# Altium schematic sheet MatchX_SoM24.SchDoc: =title
size A3; PageSetup: Record=PageOptions|CenterHorizontal=True|CenterVertical=True|PrintScale=1.00|XCorrection=1.00|YCorrection=1.00|PrintKind=0|BorderSize=5000000|LeftOffset=0|BottomOffset=0|Orientation=2|PaperLength=1000|PaperWidth=1000|Scale=100|PaperSource=15|PrintQuality=600|MediaType=1|DitherType=10|PaperKind=Letter|PrintScaleMode=1; DocumentNumber: 5; SheetNumber: 4; SheetTotal: 7
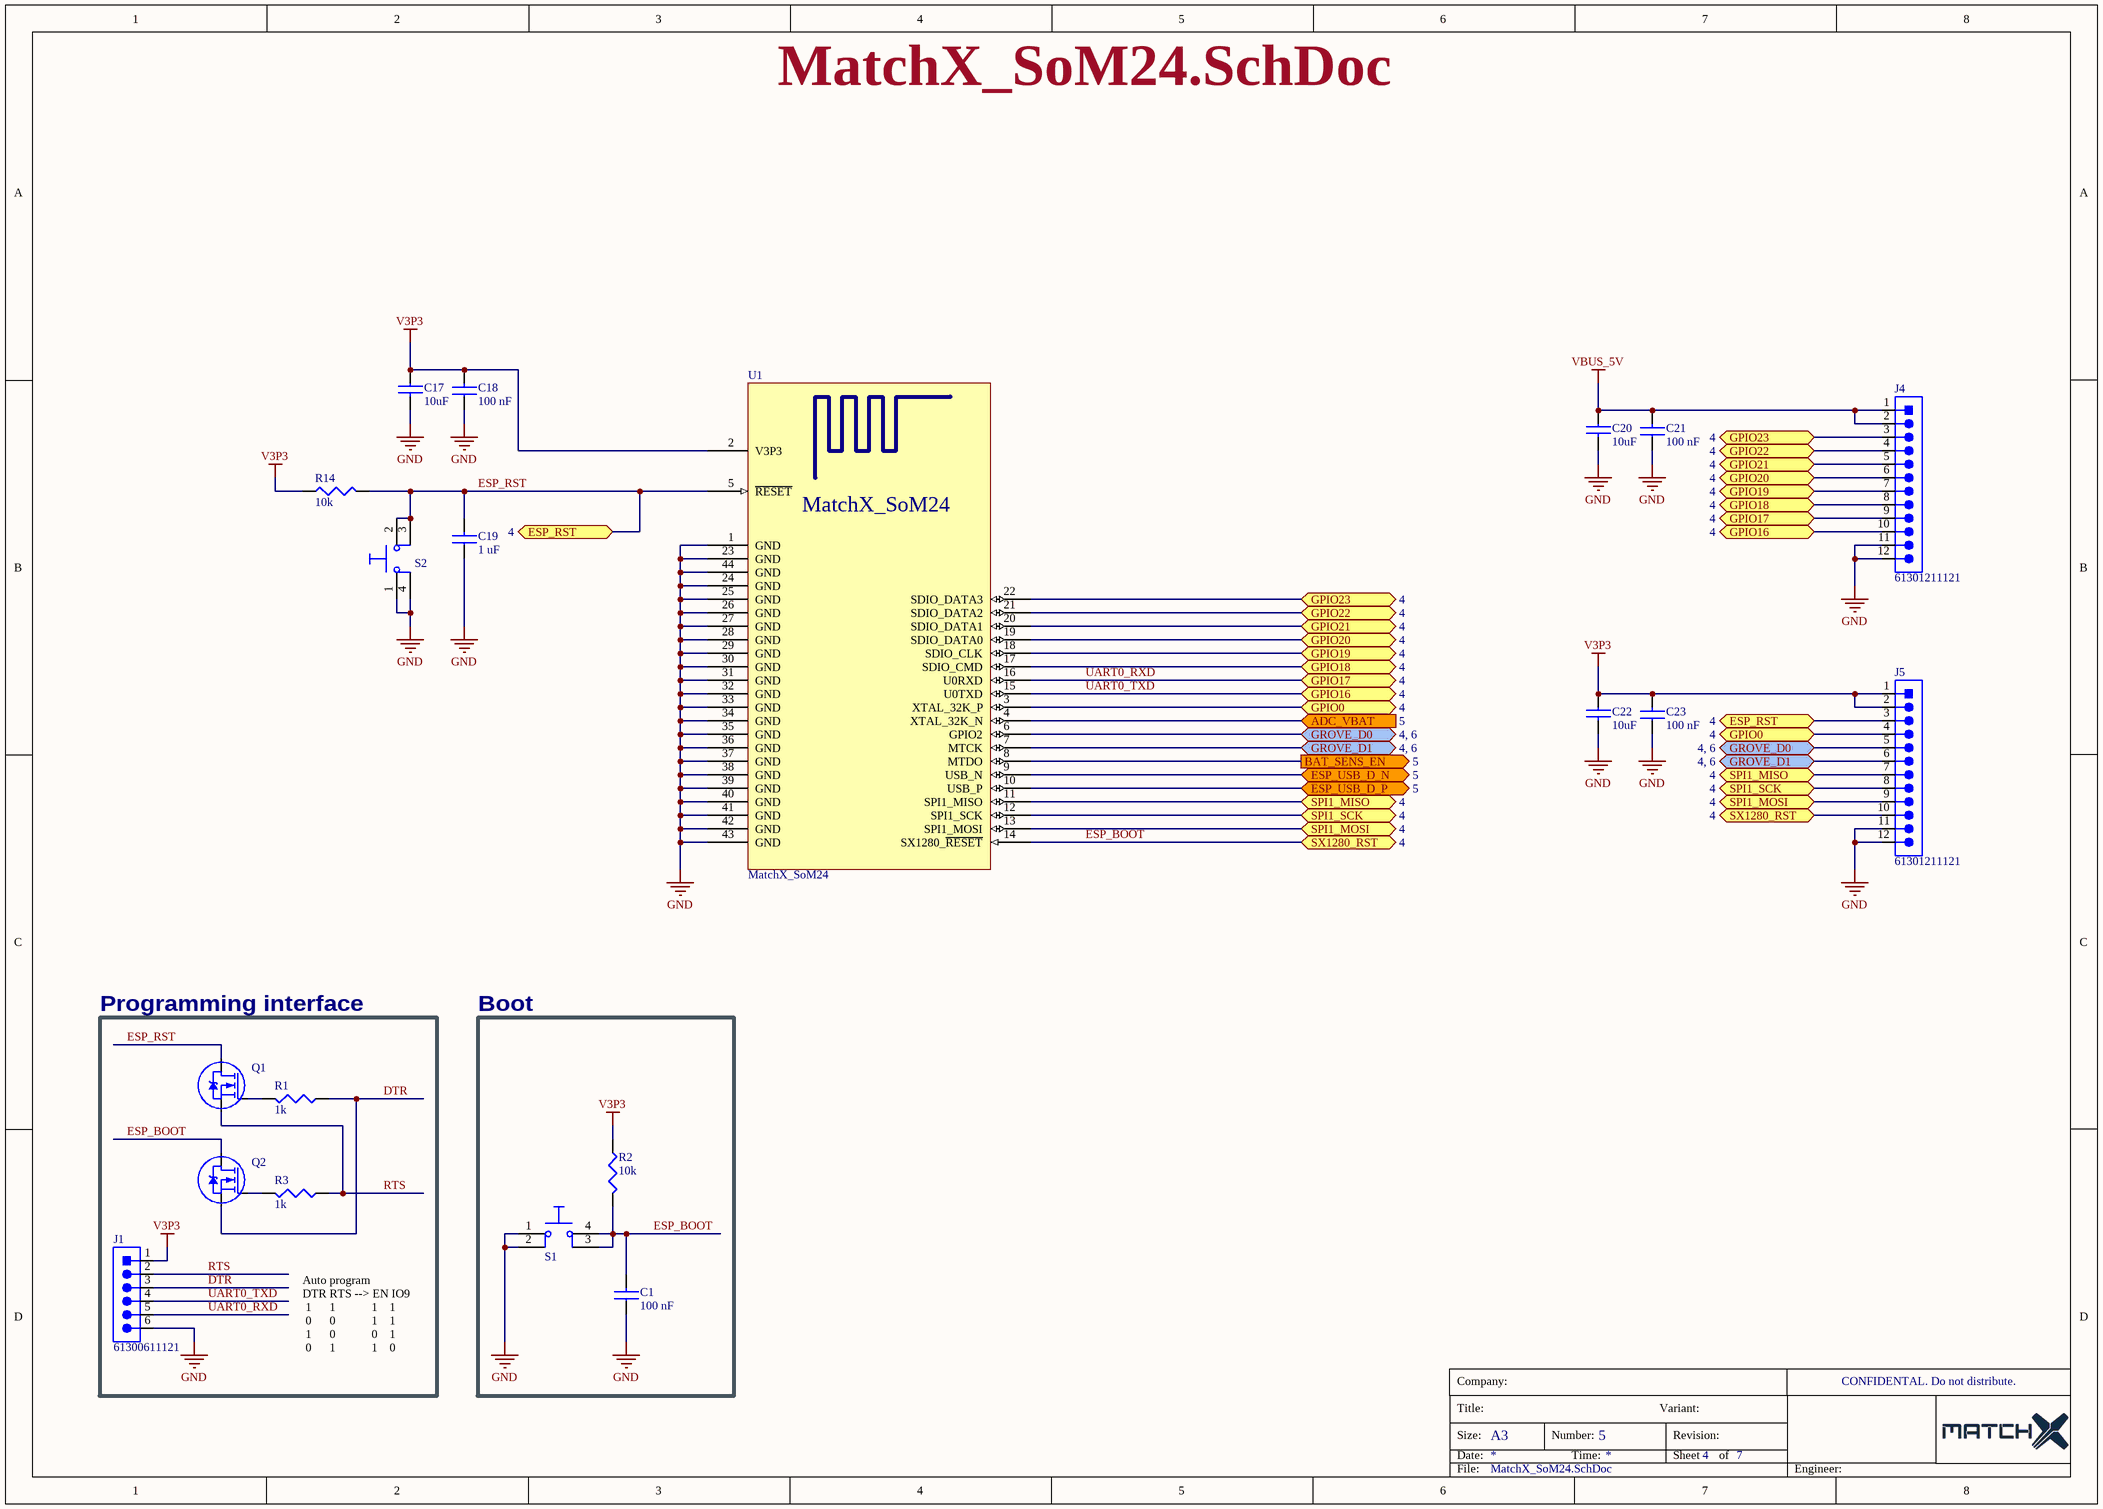
[diagram p0: MatchX_SoM24.SchDoc]

## Parts
C1  100 nF  [C0603]
C17  10uF  [C0805]
C18  100 nF  [C0603]
C19  1 uF  [C0603]
C20  10uF  [C0805]
C21  100 nF  [C0603]
C22  10uF  [C0805]
C23  100 nF  [C0603]
J1  61300611121  [WURTH_61300611121]
J4  61301211121  [WURTH_61301211121]
J5  61301211121  [WURTH_61301211121]
Q1  DMN3023L-7  [SOT-23]  (value not drawn)
Q2  DMN3023L-7  [SOT-23]  (value not drawn)
R1  1k  [R0603]
R2  10k  [R0402]
R3  1k  [R0603]
R14  10k  [R0402]
S1  TS-1108A  [TS-1108A]  (value not drawn)
S2  TS-1108A  [TS-1108A]  (value not drawn)
U1  MatchX_SoM24  [MatchX_SoM24]

## Blocks framed on the sheet
Programming interface: J1 Q1 Q2 R1 R3
Boot: C1 R2 S1

## Ports
ADC_VBAT (in, see 5), BAT_SENS_EN (out, see 5), ESP_RST (bidir, see 4), ESP_USB_D_N (bidir, see 5), ESP_USB_D_P (bidir, see 5), GPIO0 (bidir, see 4), GPIO16 (bidir, see 4), GPIO17 (bidir, see 4), GPIO18 (bidir, see 4), GPIO19 (bidir, see 4), GPIO20 (bidir, see 4), GPIO21 (bidir, see 4), GPIO22 (bidir, see 4), GPIO23 (bidir, see 4), GROVE_D0 (bidir, see 4, 6), GROVE_D1 (bidir, see 4, 6), SPI1_MISO (bidir, see 4), SPI1_MOSI (bidir, see 4), SPI1_SCK (bidir, see 4), SX1280_RST (bidir, see 4)

## Nets
GND: C1.1 C17.2 C18.1 C19.1 C20.2 C21.1 C22.2 C23.1 J1.6 J4.11 J4.12 J5.11 J5.12 S1.1 S1.2 S2.1 S2.4 U1.1(GND) U1.23(GND) U1.24(GND) U1.25(GND) U1.26(GND) U1.27(GND) U1.28(GND) U1.29(GND) U1.30(GND) U1.31(GND) U1.32(GND) U1.33(GND) U1.34(GND) U1.35(GND) U1.36(GND) U1.37(GND) U1.38(GND) U1.39(GND) U1.40(GND) U1.41(GND) U1.42(GND) U1.43(GND) U1.44(GND)
V3P3: C17.1 C18.2 C22.1 C23.2 J1.1 J5.1 J5.2 R2.1 R14.1 U1.2(V3P3)
VBUS_5V: C20.1 C21.2 J4.1 J4.2
ADC_VBAT: U1.4(XTAL_32K_N) ; port ADC_VBAT
BAT_SENS_EN: U1.8(MTDO) ; port BAT_SENS_EN
DTR: J1.3 Q2.2(S) R1.2
ESP_BOOT: C1.2 J5.10 Q2.3(D) R2.2 S1.3 S1.4 U1.14(SX1280_~{RESET}) ; port SX1280_RST
ESP_RST: C19.2 J5.3 Q1.3(D) R14.2 S2.2 S2.3 U1.5(~{RESET}) ; port ESP_RST
ESP_USB_D_N: U1.9(USB_N) ; port ESP_USB_D_N
ESP_USB_D_P: U1.10(USB_P) ; port ESP_USB_D_P
GPIO0: J5.4 U1.3(XTAL_32K_P) ; port GPIO0
GPIO18: J4.8 U1.17(SDIO_CMD) ; port GPIO18
GPIO19: J4.7 U1.18(SDIO_CLK) ; port GPIO19
GPIO20: J4.6 U1.19(SDIO_DATA0) ; port GPIO20
GPIO21: J4.5 U1.20(SDIO_DATA1) ; port GPIO21
GPIO22: J4.4 U1.21(SDIO_DATA2) ; port GPIO22
GPIO23: J4.3 U1.22(SDIO_DATA3) ; port GPIO23
GROVE_D0: J5.5 U1.6(GPIO2) ; port GROVE_D0
GROVE_D1: J5.6 U1.7(MTCK) ; port GROVE_D1
RTS: J1.2 Q1.2(S) R3.2
SPI1_MISO: J5.7 U1.11(SPI1_MISO) ; port SPI1_MISO
SPI1_MOSI: J5.9 U1.13(SPI1_MOSI) ; port SPI1_MOSI
SPI1_SCK: J5.8 U1.12(SPI1_SCK) ; port SPI1_SCK
UART0_RXD: J1.5 J4.9 U1.16(U0RXD) ; port GPIO17
UART0_TXD: J1.4 J4.10 U1.15(U0TXD) ; port GPIO16
NetQ1_1: Q1.1(G) R1.1
NetQ2_1: Q2.1(G) R3.1

## Notes on the sheet
- Auto program
  DTR RTS --> EN IO9
  1      1            1    1
  0      0            1    1
  1      0            0    1
  0      1            1    0
- Company:
- CONFIDENTAL. Do not distribute.
- Title:
- Size:
- Date:
- A3
- Number:
- Time:
- Variant:
- Revision:
- Sheet
- of
- File:
- Engineer:

## Library data of the parts
C1 C18 C21 C23 = C0603-100nF_50V: CAP, CERM, 100 nF, 50V, +/- 10%, X7R, 0603; CompType: Capacitor; Category: Capacitors; Operating Temperature: -55°C ~ 125°C; Package / Case: 0603 (1608 Metric); RoHS: RoHS Compliant; Temperature Coefficient: X7R; Tolerance: 10%; Voltage - Rated: 50V; MountType: SMT; Technology: Ceramic; Value: 100 nF
C17 C20 C22 = C0805-10uF_16V: CAP, CERM, 10uF, 16V, +/- 20%, X5R, 0805; CompType: Capacitor; Category: Capacitors; Operating Temperature: -55°C ~ 85°C; Package / Case: 0805 (2012 Metric); RoHS: RoHS Compliant; Temperature Coefficient: X5R; Tolerance: 20%; Voltage - Rated: 16 V; MountType: SMT; Technology: Ceramic; Value: 10uF
C19 = C0603-1uF_25V: CAP, CERM, 1 uF, 25 V, +/- 10%, X7R, 0603; Voltage - Rated: 25 V; CompType: Capacitor; Category: Capacitors; Operating Temperature: -55°C ~ 125°C; Package / Case: 0603 (1608 Metric); RoHS: RoHS Compliant; Temperature Coefficient: X7R; Tolerance: 10%; MountType: SMT; Technology: Ceramic; Value: 1 uF
J1 = CON_61300611121: Header, 2.54 mm, 6x1, Gold, TH; Manufacturer: Wurth Electronics; Connector Type: Header, Unshrouded; Number of Positions: 6; Number of Positions Loaded: All; Pitch: 0.100" (2.54mm); Supplier 1: Digikey; Supplier Part Number 1: 732-5318-ND; Manufacturer Part Number: 61300611121; Stock 1: 0; Pricing 1: 1=0.25, 10=0.209, 25=0.174, 50=0.145, 100=0.132, 1000=0.12 (USD); Category: Connectors, Interconnects; Family: Rectangular Connectors - Headers, Male Pins; Series: WR-PHD; Packaging: Bulk; Contact Type: Male Pin; Number of Rows: 1; Row Spacing: -; Contact Mating Length: 0.236" (6.00mm); Mounting Type: Through Hole; Termination: Solder; Fastening Type: -; Features: -; Contact Finish: Gold; Contact Finish Thickness: -; Color: Black; ComponentLink1URL: http://www.farnell.com/cad/1737268.pdf; ComponentLink1Description: http://www.farnell.com/cad/1737268.pdf
J4 J5 = CON_61301211121: Header, 2.54 mm, 12x1, Gold, TH; Manufacturer: Wurth Electronics; Connector Type: Header, Unshrouded; Number of Positions: 12; Number of Positions Loaded: All; Pitch: 0.100" (2.54mm); Supplier 1: Digikey; Supplier Part Number 1: 732-5323-ND; Manufacturer Part Number: 61301211121; Stock 1: 459; Pricing 1: 1=0.54, 10=0.454, 25=0.3792, 50=0.316, 100=0.287, 1000=0.261 (USD); Category: Connectors, Interconnects; Family: Rectangular Connectors - Headers, Male Pins; Series: WR-PHD; Packaging: Bulk; Contact Type: Male Pin; Number of Rows: 1; Row Spacing: -; Contact Mating Length: 0.236" (6.00mm); Mounting Type: Through Hole; Termination: Solder; Fastening Type: -; Features: -; Contact Finish: Gold; Contact Finish Thickness: -; Color: Black; ComponentLink1URL: http://www.farnell.com/cad/1737268.pdf; ComponentLink1Description: http://www.farnell.com/cad/1737268.pdf
Q1 Q2 = NMOSFET_DMN3023L-7: MOSFETN-CH 30V 6.2A SOT23-3; Manufacturer: Diodes; .Checked PCB: OK M; Rds On Max: 25mR; Input Capacitance: 873pF; Max Power Dissipation: 900mW; Supplier 1: Digi-Key; Supplier Part Number 1: DMN3023L-7DICT-ND; Manufacturer Part Number: DMN3023L-7; RoHS: Yes; Category: MOSFETs; Stock 1: 420813; Pricing 1: 1=0,41000, 10=0,33100, 100=0,22560, 500=0,16922, 1000=0,12692 (USD); RoHS Compliant: Yes; ComponentLink1URL: http://www.farnell.com/datasheets/2814401.pdf?src-supplier=Farnell; ComponentLink1Description: http://www.farnell.com/datasheets/2814401.pdf?src-supplier=Farnell; ComponentLink2URL: http://www.mouser.com/ds/2/115/DMN3023L-959533.pdf?src-supplier=Mouser; ComponentLink2Description: http://www.mouser.com/ds/2/115/DMN3023L-959533.pdf?src-supplier=Mouser; ComponentLink3URL: http://www.farnell.com/datasheets/2814401.pdf?src-supplier=Newark; ComponentLink3Description: http://www.farnell.com/datasheets/2814401.pdf?src-supplier=Newark; ComponentLink4URL: http://www.farnell.com/datasheets/2814401.pdf?src-supplier=Element14; ComponentLink4Description: http://www.farnell.com/datasheets/2814401.pdf?src-supplier=Element14; .Checked SCH: OK M; Mount: Surface Mount; Case/Package: TO-236-3; Min Operating Temperature: -55°C; Max Operating Temperature: 150°C; Packaging: Tape and Reel; Drain to Source Voltage (Vdss): 30V; Continuous Drain Current (ID): 6.2A; ComponentLink5URL: https://www.diodes.com/assets/Datasheets/DMN3023L.pdf?src-supplier=Digi-Key; ComponentLink5Description: https://www.diodes.com/assets/Datasheets/DMN3023L.pdf?src-supplier=Digi-Key
R1 R3 = R0603-1k: RES, 1k, 1%, 0.063 W, 0603; Power (Watts): 0.063W, 1/16W; .Checked PCB: OK RF; .Checked SCH: RF; Category: Resistors; Package / Case: 0603 [1608 Metric]; Tolerance: ±1%; Value: 1k; RoHS: RoHS Compliant; Composition: Thick Film; Features: -; Size / Dimension: 0.063" L x 0.031" W (1.60mm x 0.80mm); Height: 0.016" (0.40mm); Number of Terminations: 2
R2 R14 = R0402-10k: RES, 10k, 1%, 1/16 W, 0402; Power (Watts): 0.063W, 1/16W; .Checked PCB: OK RF; .Checked SCH: RF; Category: Resistors; Package / Case: 0402; Tolerance: ±1%; Value: 10k; RoHS: RoHS Compliant; Composition: Thick Film; Features: -; Size / Dimension: 0.039" L x 0.020" W (1.00mm x 0.50mm); Height: 0.016" (0.40mm); Number of Terminations: 2
S1 S2 = TS-1108A: Switch Tactile N.O. SPST Button 12VDC 50mA 5N SMD T/R; Manufacturer: ROPARTS; Manufacturer Part Number: TS-1108A; RoHS: Yes; Stock 1: 3728; Pricing 1: 1=0,78000, 10=0,69500, 50=0,62700, 100=0,59800, 1000=0,48400, 10000=0,46500 (USD)
U1 = MatchX_SoM24: MatchX_SoM24 LoRa, Wi-Fi 6 + Bluetooth 5 (LE); Manufacturer: MatchX; Manufacturer Part Number: MatchX_SoM24